# Altium schematic sheet JTAG&SWD.SchDoc
size A4; Revision: B.1(PCB.SCH)
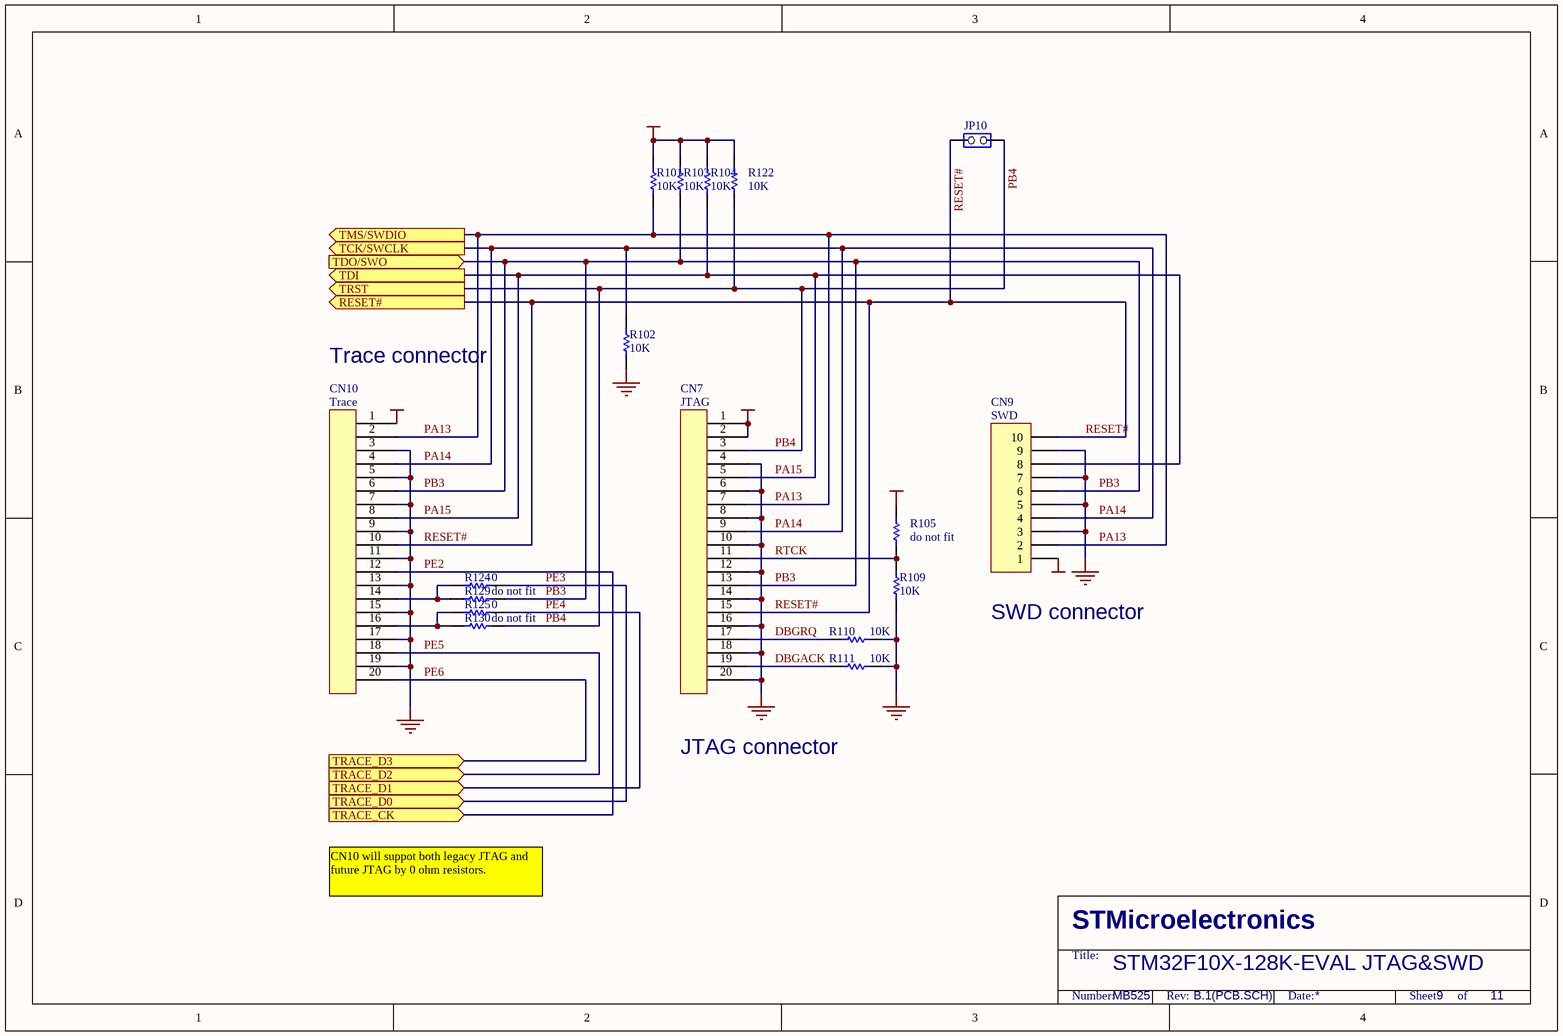
[diagram p0: JTAG&SWD.SchDoc]

## Parts
CN7  JTAG  [IDC20S]
CN9  SWD  [IDC10S]
CN10  Trace  [IDC20S]
JP10  (no value)  [SIP2]
R101  10K  [0603]
R102  10K  [0603]
R103  10K  [0603]
R104  10K  [0603]
R105  do not fit  [0603]
R109  10K  [0603]
R110  10K  [0603]
R111  10K  [0603]
R122  10K  [0603]
R124  0  [0603]
R125  0  [0603]
R129  do not fit  [0603]
R130  do not fit  [0603]

## Ports
RESET# (out), TCK/SWCLK (out), TDI (out), TDO/SWO (in), TMS/SWDIO (out), TRACE_CK (in), TRACE_D0 (in), TRACE_D1 (in), TRACE_D2 (in), TRACE_D3 (in), TRST (out)

## Nets
+3V3: CN7.1 CN7.2 CN9.1 CN10.1 R101.2 R103.2 R104.2 R105.2 R122.2
GND: CN7.4 CN7.6 CN7.8 CN7.10 CN7.12 CN7.14 CN7.16 CN7.18 CN7.20 CN9.3 CN9.5 CN9.7 CN9.9 CN10.3 CN10.5 CN10.7 CN10.9 CN10.11 CN10.13 CN10.15 CN10.17 CN10.19 R102.1 R109.1 R110.2 R111.2
DBGACK: CN7.19 R111.1
DBGRQ: CN7.17 R110.1
PA13: CN7.7 CN9.2 CN10.2 R101.1 ; port TMS/SWDIO
PA14: CN7.9 CN9.4 CN10.4 R102.2 ; port TCK/SWCLK
PA15: CN7.5 CN9.8 CN10.8 R104.1 ; port TDI
PB3: CN7.13 CN9.6 CN10.6 R103.1 R129.2 ; port TDO/SWO
PB4: CN7.3 JP10.1(COMMON) R122.1 R130.2 ; port TRST
PE2: CN10.12 ; port TRACE_CK
PE3: R124.2 ; port TRACE_D0
PE4: R125.2 ; port TRACE_D1
PE5: CN10.18 ; port TRACE_D2
PE6: CN10.20 ; port TRACE_D3
RESET#: CN7.15 CN9.10 CN10.10 JP10.2(NO) ; port RESET#
RTCK: CN7.11 R105.1 R109.2
NetCN10_14: CN10.14 R124.1 R129.1
NetCN10_16: CN10.16 R125.1 R130.1

## Notes on the sheet
- Trace connector
- (near CN9) SWD connector
- JTAG connector
- CN10 will suppot both legacy JTAG and future JTAG by 0 ohm resistors.
- STM32F10X-128K-EVAL JTAG&SWD
- MB525
- 9
- 11
- STMicroelectronics
- Title:
- Number:
- Rev:
- Date:
- Sheet       of

## Library data of the parts
CN7 CN10 = 20PIN1
CN9 = Header 10: Header, 10-Pin; Revision: 17-Jul-2002: Re-released for DXP Platform.; Publisher: Altium Limited
JP10 = JP2
R101-R105 R109-R111 R122 R124 R125 R129 R130 = Res1: Resistor; Value: 1K; Published: 8-Jun-2000; Revision: July-2002: Re-released for DXP Platform.; Publisher: Altium Limited